# EAGLE design XL4432-SMT3 (EAGLE 6.4)
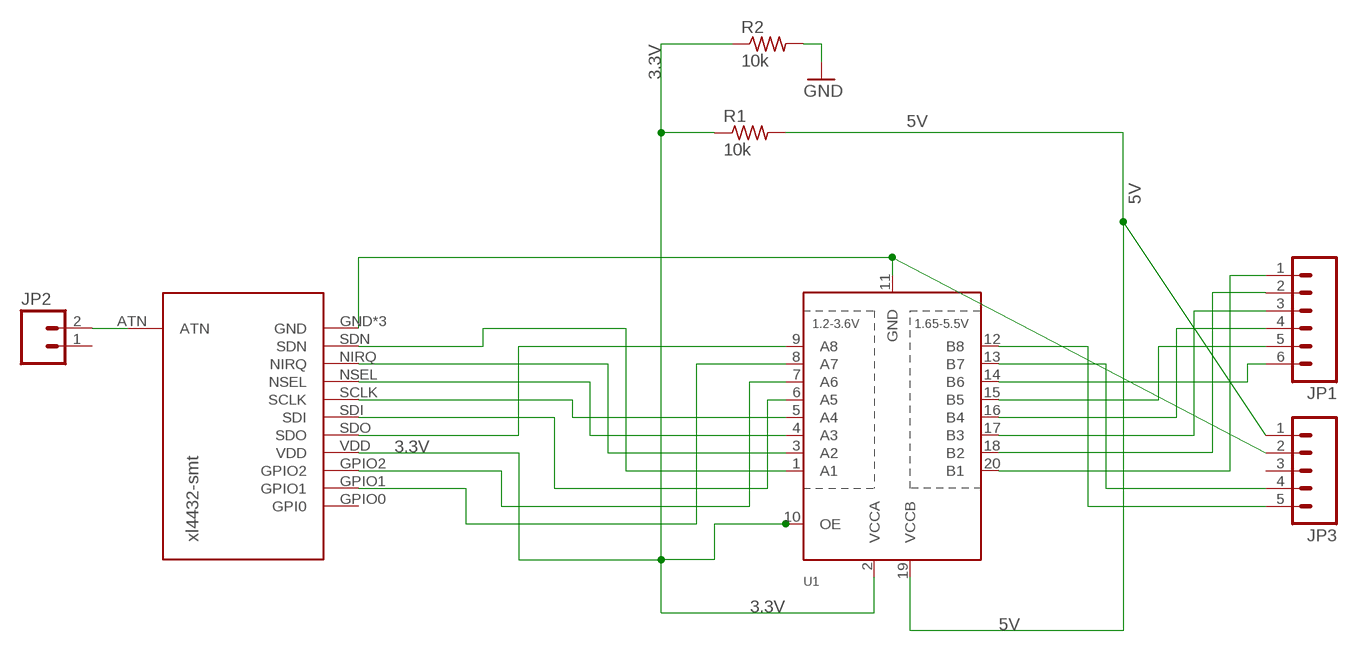
[diagram p0: schematic, sheet 1]

## Parts
JP1  M06LOCK  [1X06_LOCK]
JP2  M02LOCK  [1X02_LOCK]
JP3  M05LOCK  [1X05_LOCK]
R1  10k  R-US_R0805  [R0805]
R2  10k  R-US_R0805  [R0805]
U1  TXB0108PWR  [TSSOP20]
U$1  XL4432-SMT  [XL4432-SMT]

## Nets
3.3V: R1.1 R2.1 U1.2(VCCA) U1.10(OE) U$1.VDD
5V: JP3.1 R1.2 U1.19(VCCB)
GND: JP3.2 R2.2 U1.11(GND) U$1.GND U$1.GND1(GND) U$1.GND3(GND)
N$2: U1.9(A8) U$1.SDO
N$3: U1.1(A1) U$1.SDN
N$4: JP1.1 U1.20(B1)
N$5: U1.3(A2) U$1.NIRQ
N$6: U1.4(A3) U$1.NSEL
N$7: U1.5(A4) U$1.SCLK
N$8: U1.6(A5) U$1.SDI
N$9: U1.7(A6) U$1.GPIO2
N$10: U1.8(A7) U$1.GPIO1
N$11: JP1.2 U1.18(B2)
N$12: JP2.2 U$1.ATN
N$14: JP1.3 U1.17(B3)
N$15: JP1.4 U1.16(B4)
N$16: JP1.5 U1.15(B5)
N$17: JP1.6 U1.14(B6)
N$18: JP3.4 U1.13(B7)
N$19: JP3.5 U1.12(B8)
Unconnected: JP2.1 JP3.3 U$1.GPIO0(GPI0)

## Library data of the parts
JP1 = SparkFun:M06: Header 6 Standard 6-pin 0.1" header. Use with straight break away headers (SKU : PRT-00116), right angle break away headers (PRT-00553), swiss pins (PRT-00743), machine pins (PRT-00117), and female headers (PRT-00115). Molex polarized connector foot print use with SKU : PRT-08094 with associated crimp pins and housings. NOTES ON THE VARIANTS LOCK and LOCK_LONGPADS... This footprint was designed to help hold the alignment of a through-hole component (i.e. 6-pin header) while soldering it into place. You may notice that each hole has been shifted either up or down by 0.005 of an inch from it's more standard position (which is a perfectly straight line). This slight alteration caused the pins (the squares in the middle) to touch the edges of the holes. Because they are alternating, it causes a "brace" to hold the component in place. 0.005 has proven to be the perfect amount of "off-center" position when using our standard breakaway headers. Although looks a little odd when you look at the bare footprint, once you have a header in there, the alteration is very hard to notice. Also, if you push a header all the way into place, it is covered up entirely on the bottom side. This idea of altering the position of holes to aid alignment will be further integrated into the Sparkfun Library for other footprints. It can help hold any component with 3 or more connection pins.
JP2 = SparkFun:M02: Header 2 Standard 2-pin 0.1" header. Use with straight break away headers (SKU : PRT-00116), right angle break away headers (PRT-00553), swiss pins (PRT-00743), machine pins (PRT-00117), and female headers (PRT-00115). Molex polarized connector foot print use with SKU : PRT-08233 with associated crimp pins and housings.
JP3 = SparkFun:M05: Header 5 Standard 5-pin 0.1" header. Use with straight break away headers (SKU : PRT-00116), right angle break away headers (PRT-00553), swiss pins (PRT-00743), machine pins (PRT-00117), and female headers (PRT-00115). Molex polarized connector foot print use with SKU : PRT-08230 with associated crimp pins and housings.
R1 R2 = resistor:R-US_: RESISTOR, American symbol
U1 = microbuilder:TXB0108PWR: 8-Bit Bi-Directional Level Shifter 1.2V-3.6V (VCCA) to 1.65V-5.5V (VCCB) bi-directional level shifter with auto direction sensing. Max data rate - VCCA 1.8V: 20Mbps (50ns), VCCA 3.3V: 100Mbps (10ns) Digikey: 296-21527-1-ND
U$1 = Random parts:XL4432-SMT

## Board
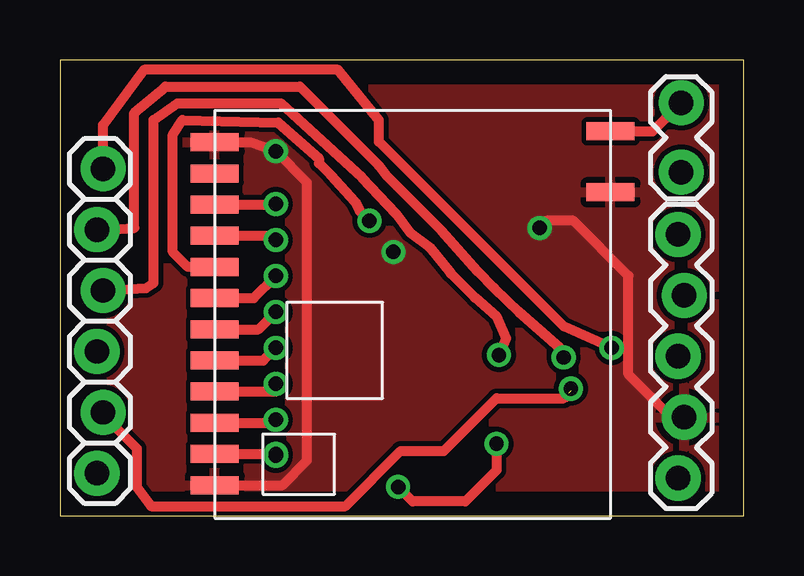
[diagram p1: board, top side]
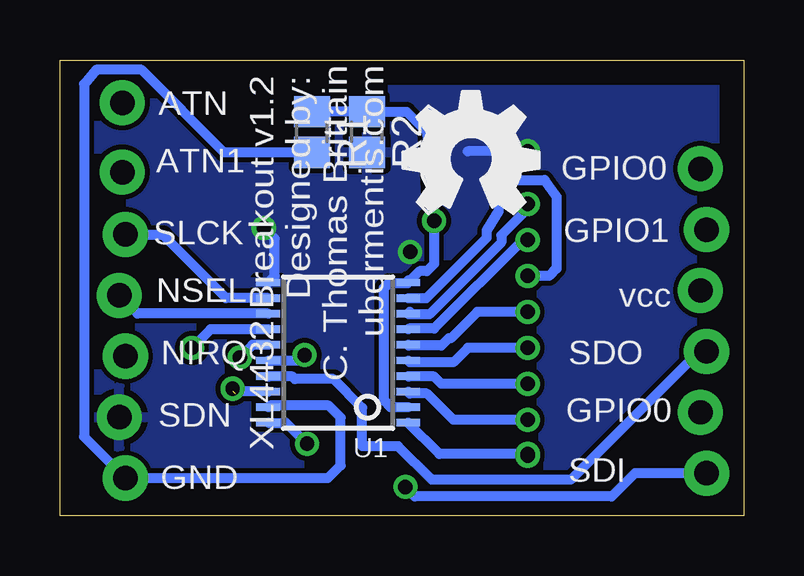
[diagram p2: board, bottom side, seen from below]

Size 28.5 x 19 mm. Coordinates in mm from the lower left corner, seen from the top.
Outline: 0,0 28.5,0 28.5,19 0,19 0,0
Copper layers (1*16): Top 0.035mm / dielectric 1.5mm / Bottom 0.035mm
Design rules "default": minimum track width 10mil, minimum drill 24mil, track to track 8mil, track to pad 8mil, pad to pad 8mil, via to via 8mil, smd to smd 8mil, copper to edge 40mil, drill to drill 8mil, minimum pad ring 10mil, minimum via ring 8mil, stop-mask expansion 4mil, vias tented up to drill 0mil, thermal gap 10mil

### Footprints (pad centres in the part's own frame; a part is rotated, then mirrored left to right if it is on the bottom)
1X06_LOCK = drill 1.016 pad 1.88: 1 0,0; 2 2.54,-0.254; 3 5.08,0; 4 7.62,-0.254; 5 10.16,0; 6 12.7,-0.254
1X02_LOCK = drill 1.016 pad 1.88: 1 -0.178,0; 2 2.718,0
1X05_LOCK = drill 1.016 pad 1.88: 1 0,0.127; 2 2.54,-0.127; 3 5.08,0.127; 4 7.62,-0.127; 5 10.16,0.127
R0805 = smd 1.3 x 1.5: 1 -0.85,0; 2 0.85,0
TSSOP20 = smd 0.305 x 0.991: 1 -2.925,-2.918; 2 -2.275,-2.918; 3 -1.625,-2.918; 4 -0.975,-2.918; 5 -0.325,-2.918; 6 0.325,-2.918; 7 0.975,-2.918; 8 1.625,-2.918; 9 2.275,-2.918; 10 2.925,-2.918; 11 2.925,2.918; 12 2.275,2.918; 13 1.625,2.918; 14 0.975,2.918; 15 0.325,2.918; 16 -0.325,2.918; 17 -0.975,2.918; 18 -1.625,2.918; 19 -2.275,2.918; 20 -2.925,2.918
XL4432-SMT = smd 2 x 0.75: ATN 16.5,16.134; GND 0,15.675; GND1 0,1.375; GND3 16.5,13.594; GPIO0 0,14.375; GPIO1 0,13.075; GPIO2 0,11.775; NIRQ 0,3.975; NSEL 0,5.275; SCLK 0,6.575; SDI 0,7.875; SDN 0,2.675; SDO 0,9.175; VDD 0,10.475

### Placement (x,y rotation side)
JP1  1.54,1.77 90 top
JP2  25.9,14.5 90 top
JP3  25.9,1.57 90 top
R1  18,16 270 bottom
R2  15.7,16 270 bottom
U1  16.9,6.8 90 bottom
U$1  6.45,-0.1 0 top
U$3  [OSHW_FILLX200_NOTEXT]  14.2,12.6 0 bottom

### Tracks (layer width: path | path; a pad name or v marks a point on that pad's centre or on a via)
3.3V  (via drill 0.6)
  Top 0.406: U$1.VDD 5.33,10.38 4.7,11 4.7,15.9 5.1,16.5 9.1,16.4 10.8,14.9 10.8,14.7 11.3,14.2 12.3,13.1 12.5,12.7 v12.9,12.3
  Bottom 0.406: U1.10 13.98,9.82 | U1.2 14.72,4.53 15,4.8 15,9.5 14.8,9.7 14.01,9.7 U1.10 | R1.1 R2.1 14.05,16.85 13.2,16 13,12.6 v12.9,12.3 12.9,10.5 13.2,10.2 13.51,10.2 U1.10
5V
  Bottom 0.406: U1.19 19.74,4.6 17.3,4.6 16.8,4.1 16.8,2.1 17.33,1.57 JP3.1 27.5,3.3 27.5,18 27,18.6 25.1,18.6 21.65,15.15 R1.2
GND  (via drill 0.6)
  Top 0.406: U$1.GND 7.92,15.57 v9,15.2 10.3,13.9 10.3,2.3 9.28,1.27 U$1.GND1 | JP3.2 25.49,4.11 23.7,5.9 23.7,10 21.4,12.3 20.3,12.3 v20,12
  Bottom 0.406: v9,15.2 11.5,15.2 | U1.11 19.54,10 19.54,11.54 v20,12
  other vias: 13.9,11
  pour Bottom: -0.5,-0.5 29,-0.5 29,19.5 -0.5,19.5
  pour Top: -0.5,19.5 -0.5,-0.5 29,-0.5 29,19.5
N$2  (via drill 0.6)
  Top 0.406: U$1.SDO 8.07,9.07 v9,10
  Bottom 0.406: U1.9 13.22,9.07 10.7,11.6 10.7,11.9 10.2,12.7 10.2,13.7 9.8,14 8.3,14 7.8,13.3 7.8,10.3 8.1,10 v9,10
N$3  (via drill 0.6)
  Top 0.406: U$1.SDN v9,2.58 v9,2.5
  Bottom 0.406: v9,2.58 12.68,2.58 U1.1
N$4  (via drill 0.6)
  Top 0.406: v18.2,3 18.2,1.9 16.9,0.6 14.7,0.6 v14.1,1.2
  Bottom 0.406: U1.20 19.07,3.88 v18.2,3 | JP1.1 4.53,1.77 5.5,0.8 13.7,0.8 v14.1,1.2
N$5  (via drill 0.6)
  Top 0.406: U$1.NIRQ 9,3.88 v9,4
  Bottom 0.406: v9,4 12.1,4 13.2,5.1 13.91,5.1 U1.3
N$6  (via drill 0.6)
  Top 0.406: U$1.NSEL 9,5.17 v9,5.5
  Bottom 0.406: v9,5.5 12.6,5.5 12.9,5.8 13.96,5.8 U1.4
N$7  (via drill 0.6)
  Top 0.406: U$1.SCLK 8.47,6.47 v9,7
  Bottom 0.406: v9,7 11.5,7 12.1,6.4 13.91,6.4 U1.5
N$8  (via drill 0.6)
  Top 0.406: U$1.SDI 8.28,7.78 v9,8.5
  Bottom 0.406: v9,8.5 11.1,8.5 12.2,7.4 12.3,7.4 12.6,7.1 13.96,7.1 U1.6
N$9  (via drill 0.6)
  Top 0.406: U$1.GPIO2 8.82,11.68 v9,11.5
  Bottom 0.406: v9,11.5 9.2,11.5 12.9,7.8 13.96,7.8 U1.7
N$10  (via drill 0.6)
  Top 0.406: U$1.GPIO1 8.97,12.97 v9,13
  Bottom 0.406: 13.91,8.5 U1.8 13.96,8.4 13.1,8.4 10.1,11.4 10.1,11.7 9,12.8 v9,13
N$11  (1 unrouted)
  Top 0.406: JP1.2 1.79,4.21 3.2,2.8 3.2,1.2 3.8,0.4 11.9,0.4 14.2,2.7 16,2.7 18.2,4.9 21,4.9 21.3,5.2
  Bottom 0.406: U1.18 21.12,5.17 21.2,5.1
N$12
  Top 0.406: U$1.ATN 24.72,16.03 JP2.2
N$14
  Bottom 0.406: JP1.3 1.85,6.85 7.2,1.5 13,1.5 14.4,2.9 15.9,2.9 15.9,4.5 17.1,5.7 18.7,5.7 18.8,5.8 19.79,5.8 U1.17
N$15  (via drill 0.6)
  Top 0.406: JP1.4 3.59,9.49 3.9,9.7 3.9,16.5 4.9,17.2 9.2,17.2 12.6,14.1 14,12.6 14.6,11.8 15.4,11.2 16.3,10.1 17.3,9.1 18.2,8.3 18.6,7.4 v18.3,6.7
  Bottom 0.406: U1.16 18.52,6.47 v18.3,6.7
N$16  (via drill 0.6)
  Top 0.406: JP1.5 2.13,11.93 3.1,12 3.1,16.8 4.4,17.9 10,17.9 13.3,14.6 13.6,14.2 15.9,11.9 17.4,10.2 18.1,9.5 19.14,8.5 20.84,7 v21,6.6
  Bottom 0.406: U1.15 20.48,7.12 v21,6.6
N$17  (via drill 0.6)
  Top 0.406: JP1.6 1.79,16.29 3.5,18.6 11.6,18.6 13.3,16.5 13.3,15.6 21,7.9 v23,7
  Bottom 0.406: U1.14 22.23,7.78 v23,7
N$18
  Bottom 0.406: U1.13 25.26,8.43 JP3.4
N$19
  Bottom 0.406: U1.12 21.57,9.07 24.2,11.7 25.74,11.7 JP3.5
N$21  (via drill 0.6)
  other vias: 21.3,5.3

### Text on the board
_bsilk: XL4432 Breakout v1.2 / Designed by: / C. Thomas Brittain / ubermentis.com | ATN | GPIO0 | ATN1 | GPIO1 | SLCK | vcc | NSEL | SDO | NIRQ | GPIO0 | SDN | SDI | GND